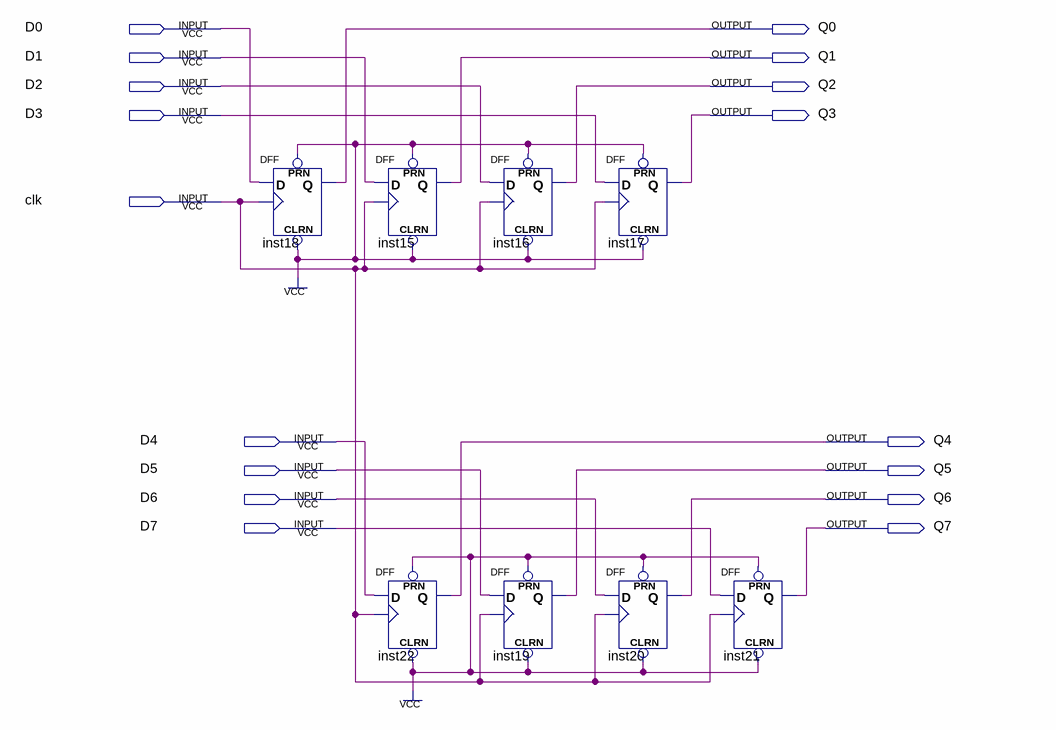
[diagram p0: schematic sheet]
// Quartus schematic resgistrador.bdf as structural Verilog: 8 symbols, 17 pins
module resgistrador (
  input  D0,
  input  D1,
  input  D2,
  input  D3,
  input  clk,
  input  D4,
  input  D5,
  input  D6,
  input  D7,
  output Q0,
  output Q1,
  output Q2,
  output Q3,
  output Q4,
  output Q5,
  output Q6,
  output Q7
);

  DFF inst18 (.CLRN(1'b1), .CLK(clk), .D(D0), .PRN(1'b1), .Q(Q0));
  DFF inst15 (.CLRN(1'b1), .CLK(clk), .D(D1), .PRN(1'b1), .Q(Q1));
  DFF inst22 (.CLRN(1'b1), .CLK(clk), .D(D4), .PRN(1'b1), .Q(Q4));
  DFF inst16 (.CLRN(1'b1), .CLK(clk), .D(D2), .PRN(1'b1), .Q(Q2));
  DFF inst19 (.CLRN(1'b1), .CLK(clk), .D(D5), .PRN(1'b1), .Q(Q5));
  DFF inst17 (.CLRN(1'b1), .CLK(clk), .D(D3), .PRN(1'b1), .Q(Q3));
  DFF inst20 (.CLRN(1'b1), .CLK(clk), .D(D6), .PRN(1'b1), .Q(Q6));
  DFF inst21 (.CLRN(1'b1), .CLK(clk), .D(D7), .PRN(1'b1), .Q(Q7));
endmodule
